# EAGLE design MWC_mobo_v1.0.7 (EAGLE 4.16)
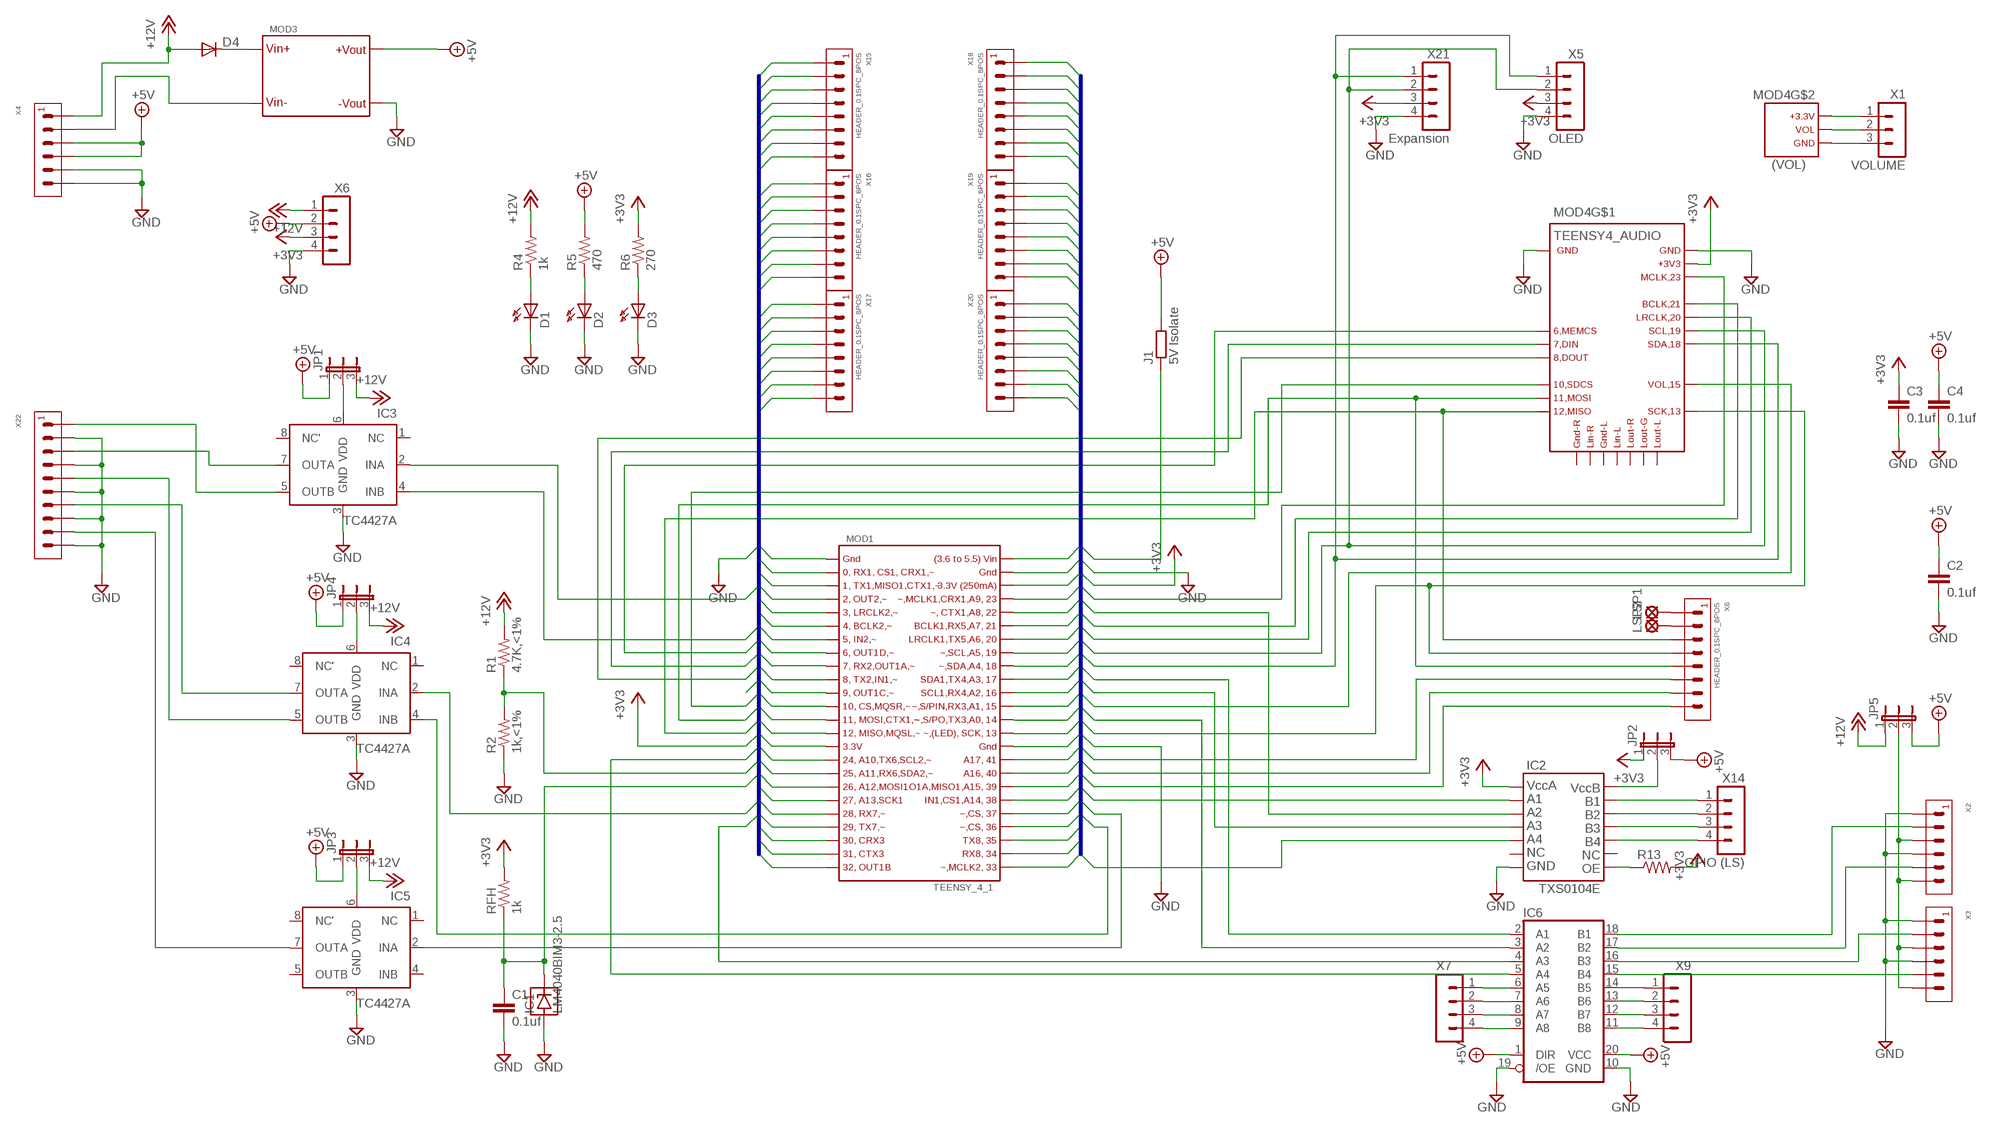
[diagram p0: schematic, sheet 1]

## Parts
C1  0.1uf  C-EUC0805K  [C0805K]
C2  0.1uf  C-EUC0805K  [C0805K]
C3  0.1uf  C-EUC0805K  [C0805K]
C4  0.1uf  C-EUC0805K  [C0805K]
D1  LED0805K  [C0805K]
D2  LED0805K  [C0805K]
D3  LED0805K  [C0805K]
D4  DIODE-SMC  [SMC]
IC1  LM4040BIM3-2.5  LM4040-SOT23  [SOT-23]
IC2  TXS0104E  TXS0104E-D  [SO14]
IC3  TC4427A  TC4427A_OA  [SO08]
IC4  TC4427A  TC4427A_OA  [SO08]
IC5  TC4427A  TC4427A_OA  [SO08]
IC6  74245-PW  [SSOP-20]
J1  5V Isolate  R-EU_R0603  [R0603@1]
JP1  JP2E  [JP2]
JP2  JP2E  [JP2]
JP3  JP2E  [JP2]
JP4  JP2E  [JP2]
JP5  JP2E  [JP2]
LSP1  LSP10  [LSP10]
LSP2  LSP10  [LSP10]
MOD1  TEENSY_4_1  [MOD-48P-0_6SPC]
MOD3  MODULE-LM2596-A  [MODULE-LM2596-A]
MOD4  TEENSY4_AUDIO  [DIP14-W]
R1  4.7K,<1%  R-US_R0805  [R0805]
R2  1k,<1%  R-US_R0805  [R0805]
R4  1k  R-US_R0805  [R0805]
R5  470  R-US_R0805  [R0805]
R6  270  R-US_R0805  [R0805]
R13  R-US_R0805  [R0805]
RFH  1k  R-US_R0603  [R0603]
X1  VOLUME  HEADER_0.1SPC_3POS  [HEADER-0.1SPC-3P]
X2  TERMINAL-BLOCK-6P-5.08-0.051D  [TERM-BLOCK_5.08SPC_6P]
X3  TERMINAL-BLOCK-6P-5.08-0.051D  [TERM-BLOCK_5.08SPC_6P]
X4  TERMINAL-BLOCK-6P-5.08-0.051D  [TERM-BLOCK_5.08SPC_6P]
X5  OLED  HEADER_0.1SPC_4POS  [HEADER-0.1SPC-4P]
X6  HEADER_0.1SPC_4POS  [HEADER-0.1SPC-4P]
X7  HEADER_0.1SPC_4POS  [HEADER-0.1SPC-4P]
X8  HEADER_0.1SPC_8POS  [HEADER-0.1SPC-8P]
X9  HEADER_0.1SPC_4POS  [HEADER-0.1SPC-4P]
X14  GPIO (LS)  HEADER_0.1SPC_4POS  [HEADER-0.1SPC-4P]
X15  HEADER_0.1SPC_8POS  [HEADER-0.1SPC-8P]
X16  HEADER_0.1SPC_8POS  [HEADER-0.1SPC-8P]
X17  HEADER_0.1SPC_8POS  [HEADER-0.1SPC-8P]
X18  HEADER_0.1SPC_8POS  [HEADER-0.1SPC-8P]
X19  HEADER_0.1SPC_8POS  [HEADER-0.1SPC-8P]
X20  HEADER_0.1SPC_8POS  [HEADER-0.1SPC-8P]
X21  Expansion  HEADER_0.1SPC_4POS  [HEADER-0.1SPC-4P]
X22  TERMINAL-BLOCK-10P-5.08-0.051D  [TERM-BLOCK_5.08SPC_10P]

## Nets
+3V3 [Power]: C3.1 IC2.1 JP2.1 MOD1.P$15 MOD1.P$46 MOD4.P$26(+3V3) R6.2 R13.2 RFH.2 X5.3 X6.3 X16.7 X18.3 X21.3
+5V [High power]: C2.1 C4.1 IC6.1(DIR) IC6.20(VCC) J1.2 JP1.1 JP2.3 JP3.1 JP4.1 JP5.3 MOD3.OUT+(VOUT+) R5.2 X4.P$3 X4.P$4 X6.2
+12V [High power]: D4.A JP1.3 JP3.3 JP4.3 JP5.1 R1.2 R4.2 X4.P$1 X6.1
GND [High power]: C1.2 C2.2 C3.2 C4.2 D1.C D2.C D3.C IC1.2(A) IC2.7 IC3.3(GND) IC4.3(GND) IC5.3(GND) IC6.10(GND) IC6.19(/OE) MOD1.P$1 MOD1.P$34 MOD1.P$47 MOD3.OUT-(VOUT-) MOD4.P$1(GND) MOD4.P$27(GND1) R2.1 X2.P$1 X2.P$4 X3.P$1 X3.P$4 X4.P$5 X4.P$6 X5.4 X6.4 X15.1 X18.2 X19.7 X21.4 X22.P$2 X22.P$4 X22.P$6 X22.P$8 X22.P$10
N$1: MOD4.VOL X1.2
N$2: MOD4.VOL_3V3 X1.1
N$3: MOD4.VOL_GND X1.3
N$4: LSP2.MP X8.2
N$5 [Power]: IC3.7(OUTA) X22.P$3
N$6: IC6.15(B4) X3.P$5
N$7: IC6.16(B3) X3.P$2
N$8: IC6.17(B2) X2.P$5
N$9: IC6.18(B1) X2.P$2
N$15: IC6.9(A8) X7.4
N$16: IC6.7(A6) X7.2
N$17: IC6.8(A7) X7.3
N$18: IC6.6(A5) X7.1
N$19: IC6.11(B8) X9.4
N$20: IC6.13(B6) X9.2
N$21: IC6.12(B7) X9.3
N$22: IC6.14(B5) X9.1
N$31: MOD3.IN-(VIN-) X4.P$2
N$32: D1.A R4.1
N$33: D2.A R5.1
N$34: D3.A R6.1
N$36: IC3.5(OUTB) X22.P$1
N$37: IC3.6(VDD) JP1.2
N$41 [Power]: IC4.7(OUTA) X22.P$7
N$50: IC4.6(VDD) JP4.2
N$51: IC2.10 X14.4
N$52: IC2.12 X14.2
N$53: IC2.11 X14.3
N$54: IC2.13 X14.1
N$57: IC2.8 R13.1
N$60: IC4.5(OUTB) X22.P$5
N$61: IC5.7(OUTA) X22.P$9
N$62 [High power]: JP5.2 X2.P$3 X2.P$6 X3.P$3 X3.P$6
N$63: IC2.14 JP2.2
N$91: LSP1.MP X8.1
N$92: IC5.6(VDD) JP3.2
N$93 [High power]: D4.C MOD3.IN+(VIN+)
P1: MOD1.P$2 X15.2
P2: MOD1.P$3 X15.3
P3: IC3.2(INA) MOD1.P$4 X15.4
P4: MOD1.P$5 X15.5
P5: MOD1.P$6 X15.6
P6: IC3.4(INB) MOD1.P$7 X15.7
P7: MOD1.P$8 MOD4.P$8(MEMCS,P6) X15.8
P8: MOD1.P$9 MOD4.P$9(DIN,P7) X16.1
P9: MOD1.P$10 MOD4.P$10(DOUT,P8) X16.2
P10: MOD1.P$11 X16.3
P11: MOD1.P$12 MOD4.P$12(SDCS,P10) X16.4
P12: MOD1.P$13 MOD4.P$13(MOSI,P11) X8.5 X16.5
P13: MOD1.P$14 MOD4.P$14(MISO,P12) X8.3 X16.6
P15: IC6.5(A4) MOD1.P$16 X16.8
P16: MOD1.P$17 R1.1 R2.2 X17.1
P17: C1.1 IC1.1(C) MOD1.P$18 RFH.1 X17.2
P18: MOD1.P$19 X17.3
P19: IC4.2(INA) MOD1.P$20 X17.4
P20: IC6.4(A3) MOD1.P$21 X17.5
P21: MOD1.P$22 X17.6
P22: MOD1.P$23 X17.7
P23: MOD1.P$24 X17.8
P24: IC2.5 MOD1.P$25 X20.8
P25: MOD1.P$26 X20.7
P26: MOD1.P$27 X20.6
P27: IC4.4(INB) MOD1.P$28 X20.5
P28: IC5.2(INA) MOD1.P$29 X20.4
P29: IC2.2 MOD1.P$30 X20.3
P30: MOD1.P$31 X8.8 X20.2
P31: MOD1.P$32 X8.7 X20.1
P32: MOD1.P$33 X8.6 X19.8
P34: MOD1.P$35 MOD4.P$15(SCK,P13) X8.4 X19.6
P35: IC6.3(A2) MOD1.P$36 X19.5
P36: MOD1.P$37 MOD4.P$17(VOL,P15) X19.4
P37: IC2.4 MOD1.P$38 X19.3
P38: IC6.2(A1) MOD1.P$39 X19.2
P39: MOD1.P$40 MOD4.P$20(SDA,P18) X5.1 X19.1 X21.1
P40: MOD1.P$41 MOD4.P$21(SCL,P19) X5.2 X18.8 X21.2
P41: MOD1.P$42 MOD4.P$22(LRCLK,P20) X18.7
P42: MOD1.P$43 MOD4.P$23(BCLK,P21) X18.6
P43: IC2.3 MOD1.P$44 X18.5
P44: MOD1.P$45 MOD4.P$25(MCLK,P23) X18.4
P47: J1.1 MOD1.P$48 X18.1
Unconnected: IC2.6 IC2.9 IC3.1(NC) IC3.8(NC') IC4.1(NC) IC4.8(NC') IC5.1(NC) IC5.4(INB) IC5.5(OUTB) IC5.8(NC') MOD4.LINL MOD4.LINLG(GL) MOD4.LINR MOD4.LINRG(GR) MOD4.LOUTG(GOUT) MOD4.LOUTL MOD4.LOUTR

## Buses
P[0..23]
P[24..47]

## Library data of the parts
C1-C4 = rcl:C-EU: CAPACITOR, European symbol
D1-D3 = avn-led:LED: LED
D4 = diode:DIODE-: DIODE
IC1 = avn:LM4040: LM4040 -- Shunt Voltage Reference
IC2 = avn-semi:TXS0104E
IC3-IC5 = avn-semi:TC4427A: TC4427A 1.5A Dual High-Speed Power MOSFET Drivers Also TC4426A , TC4428A
IC6 = avn-semi:74245: 74245 Bi-Directional Logic Transceiver
J1 = rcl:R-EU_: RESISTOR, European symbol
JP1-JP5 = jumper:JP2E: JUMPER
LSP1 LSP2 = solpad:LSP10: SOLDER PAD drill 1.0 mm, distributor Buerklin, 12H555
MOD1 = avn-teensy:TEENSY_4_1: Teensy 4.1 Module PJRC
MOD3 = avn-power:MODULE-LM2596-A: LM2596 DC-DC Converter Vin: 3.2V - 40V Vout: 1.25V - 35V Iout: 3A
MOD4 = avn-teensy:TEENSY4_AUDIO: Teensy 4 Audio Board (Rev D) for Teensy 4.0
R1 R2 R4-R6 R13 RFH = rcl:R-US_: RESISTOR, American symbol
X1 = avn-connector:HEADER_0.1SPC_3POS: Header 0.1" spacing 3-position For 0.025" x 0.025" square pins
X2-X4 = avn-connector:TERMINAL-BLOCK-6P: Terminal Block 6-position
X5-X7 X9 X14 X21 = avn-connector:HEADER_0.1SPC_4POS: Header 0.1" spacing 4-position For 0.025" x 0.025" square pins
X8 X15-X20 = avn-connector:HEADER_0.1SPC_8POS: Header 0.1" spacing 8-position For 0.025" x 0.025" square pins
X22 = avn-connector:TERMINAL-BLOCK-10P: Screw Terminal Block

## Net classes
1 Power: width 0.508 mm
2 High power: width 0.762 mm

## Board
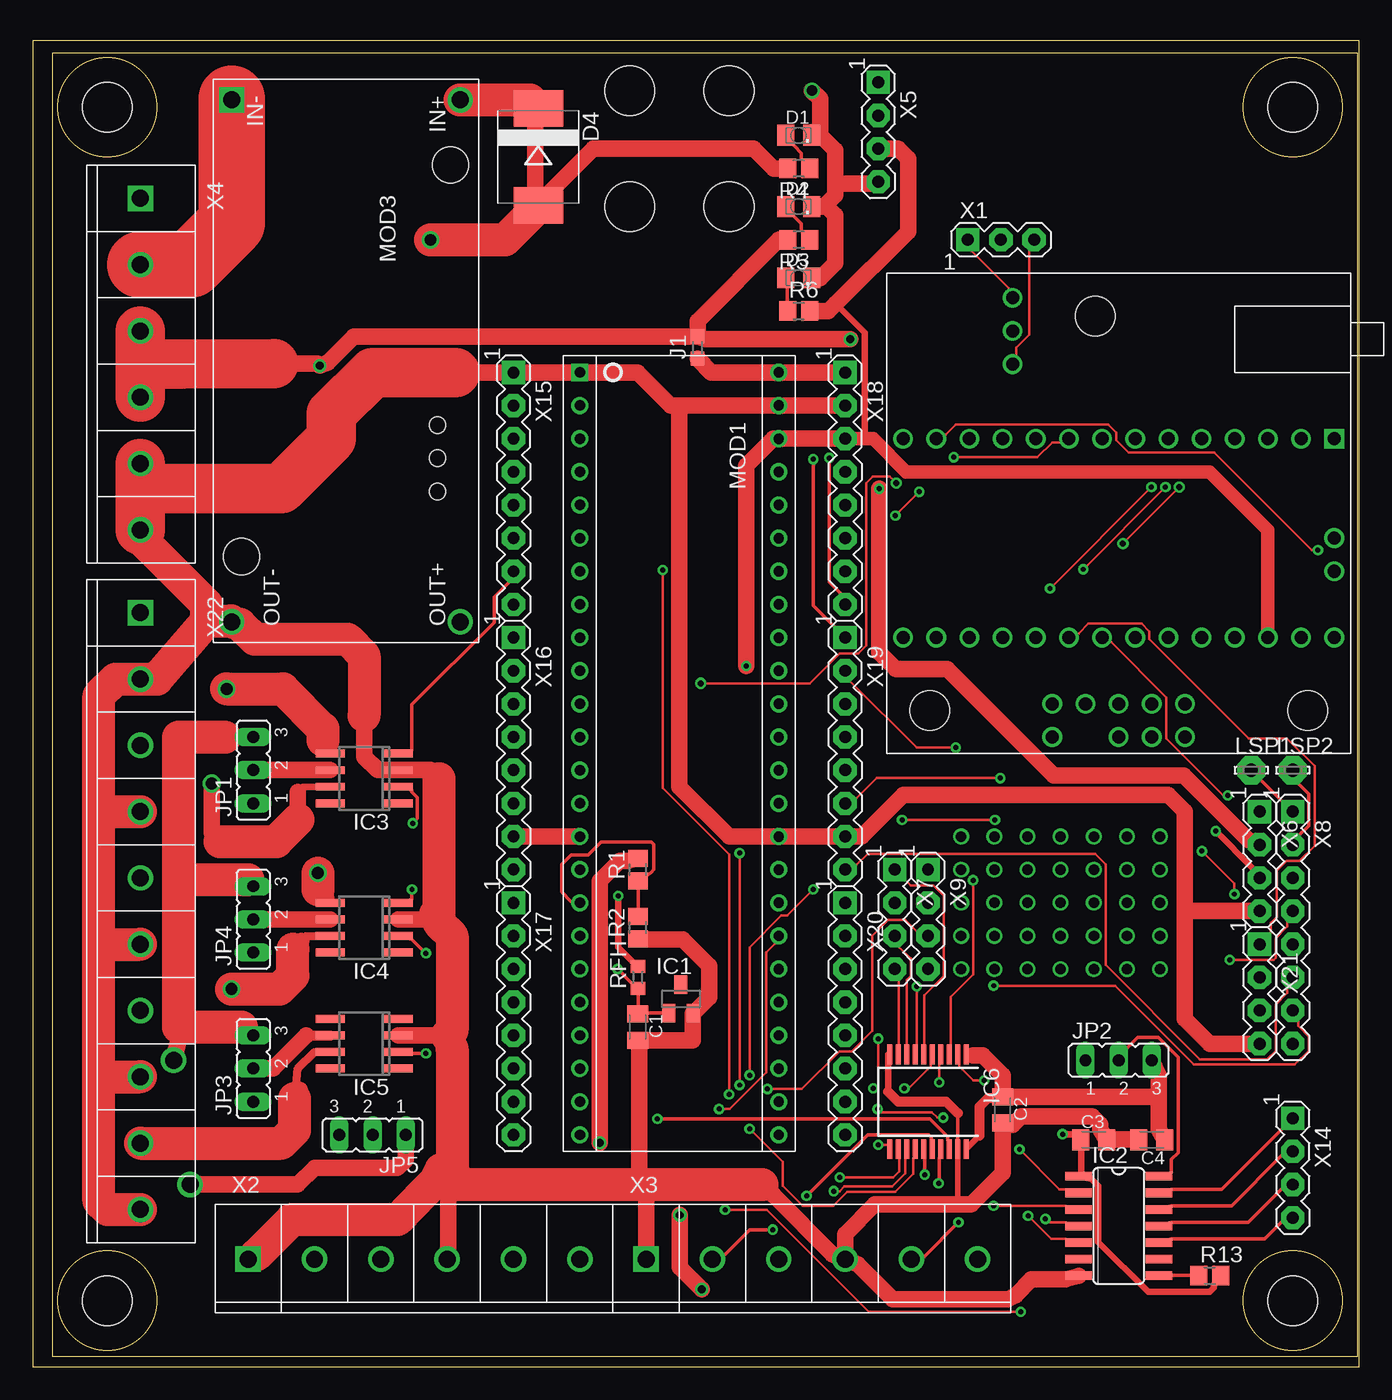
[diagram p1: board, top side]
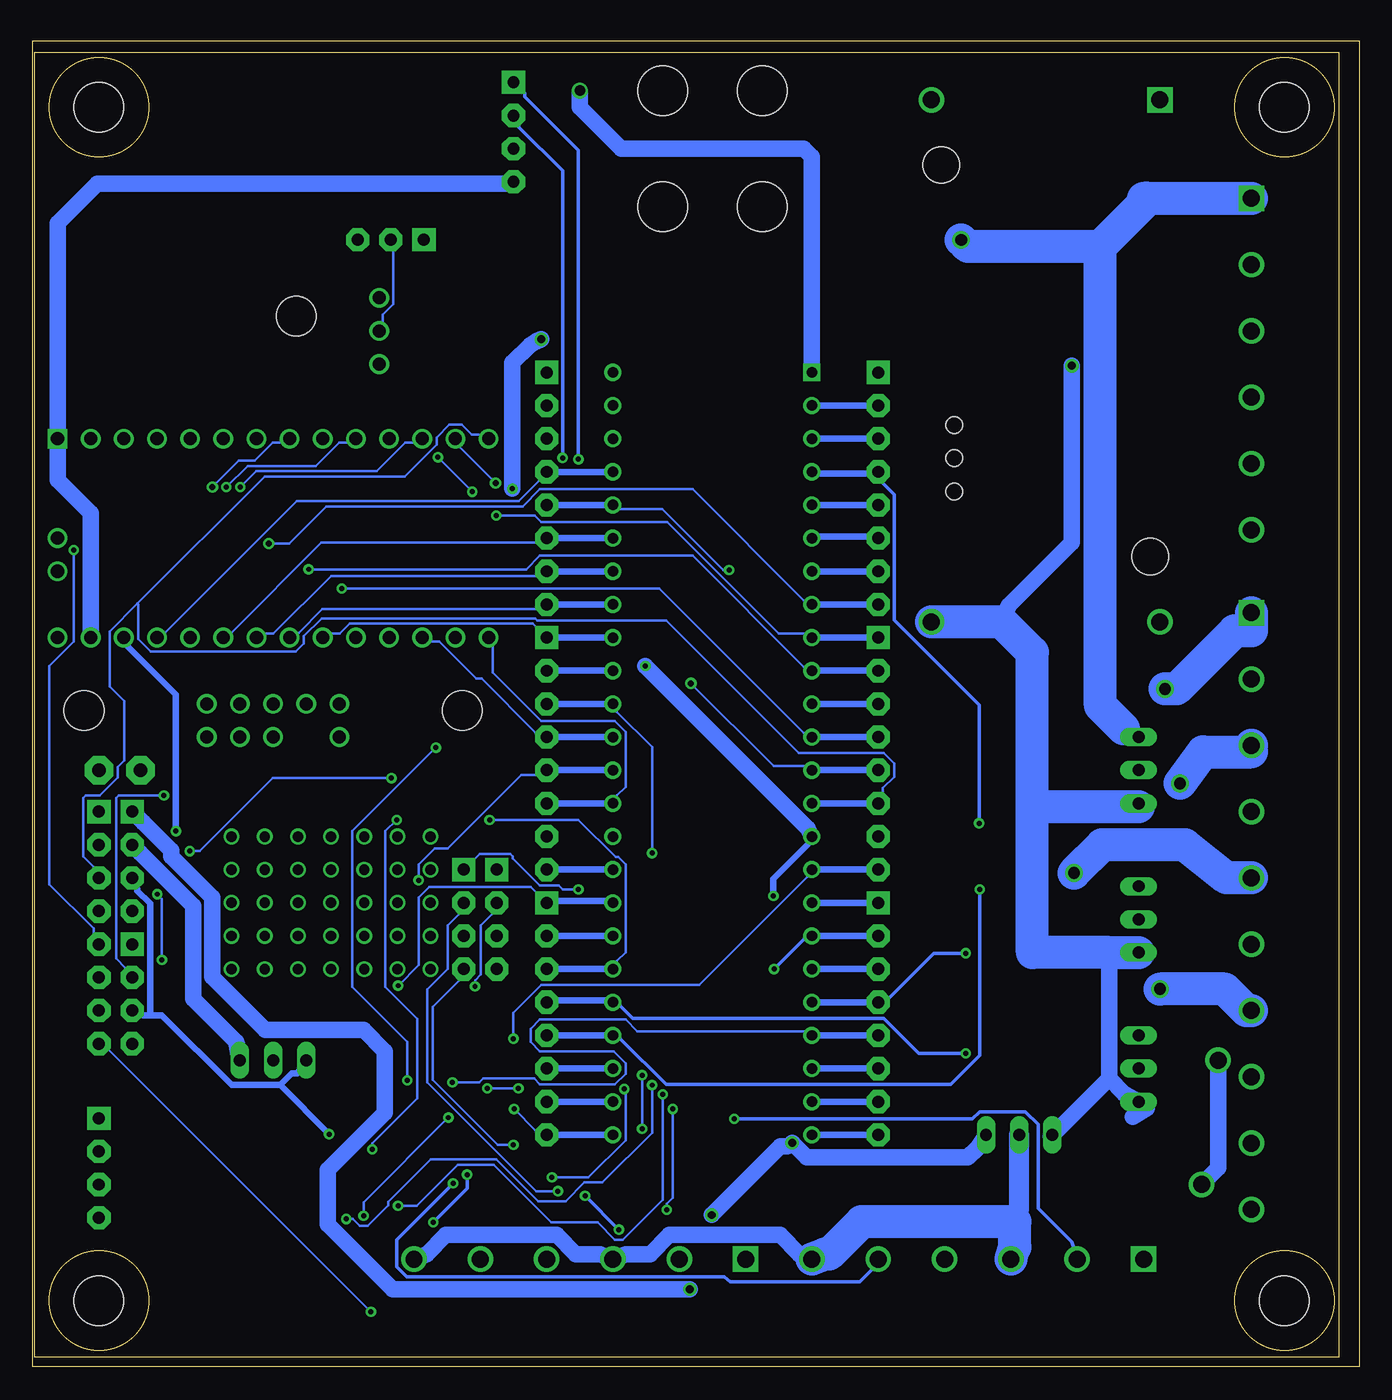
[diagram p2: board, bottom side, seen from below]

Size 101.6 x 101.6 mm. Coordinates in mm from the lower left corner, seen from the top.
Outline: 0,0 101.6,0 101.6,101.6 0,101.6 0,0
Outline: circle at 5.71,96.52 radius 3.81
Outline: circle at 5.71,5.08 radius 3.81
Outline: circle at 96.52,5.08 radius 3.81
Outline: circle at 96.52,96.52 radius 3.81
Copper layers (1*16): Top 0.035mm / dielectric 1.5mm / Bottom 0.035mm
Design rules "default": minimum track width 8mil, minimum drill 15mil, track to track 8mil, track to pad 8mil, pad to pad 8mil, via to via 8mil, smd to smd 8mil, copper to edge 40mil, drill to drill 8mil, minimum pad ring 10mil, minimum via ring 8mil, stop-mask expansion 4mil, vias tented up to drill 16mil, thermal gap 10mil
Holes 3.81 mm at 45.72,88.9 53.34,88.9 45.72,97.79 53.34,97.79 96.52,96.52 96.52,5.08 5.71,5.08 5.71,96.52
Milling: 4 lines

### Footprints (pad centres in the part's own frame; a part is rotated, then mirrored left to right if it is on the bottom)
C0805K = smd 1.3 x 1.6: 1 -1,0; 2 1,0
C0805K' = smd 1.3 x 1.6: A -1,0; C 1,0
SMC = smd 2.8 x 3.8: A 3.7,0; C -3.7,0
SOT-23 = smd 1 x 1.4: 1 -0.95,-1.1; 2 0.95,-1.1; 3 0,1.1
SO14 = smd 0.66 x 2.032: 1 -4.445,-3.073; 2 -3.175,-3.073; 3 -1.905,-3.073; 4 -0.635,-3.073; 5 0.635,-3.073; 6 1.905,-3.073; 7 3.175,-3.073; 8 3.175,3.073; 9 1.905,3.073; 10 0.635,3.073; 11 -0.635,3.073; 12 -1.905,3.073; 13 -3.175,3.073; 14 -4.445,3.073
SO08 = smd 0.6 x 2.2: 1 -1.905,-2.6; 2 -0.635,-2.6; 3 0.635,-2.6; 4 1.905,-2.6; 5 1.905,2.6; 6 0.635,2.6; 7 -0.635,2.6; 8 -1.905,2.6
SSOP-20 = smd 0.4 x 1.5: 1 -2.925,-3.625; 2 -2.275,-3.625; 3 -1.625,-3.625; 4 -0.975,-3.625; 5 -0.325,-3.625; 6 0.325,-3.625; 7 0.975,-3.625; 8 1.625,-3.625; 9 2.275,-3.625; 10 2.925,-3.625; 11 2.925,3.625; 12 2.275,3.625; 13 1.625,3.625; 14 0.975,3.625; 15 0.325,3.625; 16 -0.325,3.625; 17 -0.975,3.625; 18 -1.625,3.625; 19 -2.275,3.625; 20 -2.925,3.625
R0603@1 = smd 1.1 x 1: 1 -0.85,0; 2 0.85,0
JP2 = drill 0.914 long: 1 -2.54,0; 2 0,0; 3 2.54,0
LSP10 = drill 1.016 pad 2.159 octagon: MP 0,0
MOD-48P-0_6SPC = drill 0.8 square: P$1 -29.21,-7.62 | drill 0.8 round: P$2 -26.67,-7.62; P$3 -24.13,-7.62; P$4 -21.59,-7.62; P$5 -19.05,-7.62; P$6 -16.51,-7.62; P$7 -13.97,-7.62; P$8 -11.43,-7.62; P$9 -8.89,-7.62; P$10 -6.35,-7.62; P$11 -3.81,-7.62; P$12 -1.27,-7.62; P$13 1.27,-7.62; P$14 3.81,-7.62; P$15 6.35,-7.62; P$16 8.89,-7.62; P$17 11.43,-7.62; P$18 13.97,-7.62; P$19 16.51,-7.62; P$20 19.05,-7.62; P$21 21.59,-7.62; P$22 24.13,-7.62; P$23 26.67,-7.62; P$24 29.21,-7.62; P$25 29.21,7.62; P$26 26.67,7.62; P$27 24.13,7.62; P$28 21.59,7.62; P$29 19.05,7.62; P$30 16.51,7.62; P$31 13.97,7.62; P$32 11.43,7.62; P$33 8.89,7.62; P$34 6.35,7.62; P$35 3.81,7.62; P$36 1.27,7.62; P$37 -1.27,7.62; P$38 -3.81,7.62; P$39 -6.35,7.62; P$40 -8.89,7.62; P$41 -11.43,7.62; P$42 -13.97,7.62; P$43 -16.51,7.62; P$44 -19.05,7.62; P$45 -21.59,7.62; P$46 -24.13,7.62; P$47 -26.67,7.62; P$48 -29.21,7.62
MODULE-LM2596-A = drill 1.3 round: IN+ -20.003,8.75; OUT+ 20.003,8.75; OUT- 20.003,-8.75 | drill 1.3 square: IN- -20.003,-8.75 | hole 2.794: -15.001,8.001; 15.001,-8.001 | hole 1.27: 10.008,7.01; 7.468,7.01; 4.928,7.01
DIP14-W = drill 1 round: LINL 12.7,3.81; LINLG 15.24,3.81; LINR 12.7,1.27; LINRG 15.24,1.27; LOUTG 12.7,-3.81; LOUTL 12.7,-6.35; LOUTR 12.7,-1.27; P$2 -7.62,12.7; P$3 -7.62,10.16; P$4 -7.62,7.62; P$5 -7.62,5.08; P$6 -7.62,2.54; P$7 -7.62,0; P$8 -7.62,-2.54; P$9 -7.62,-5.08; P$10 -7.62,-7.62; P$11 -7.62,-10.16; P$12 -7.62,-12.7; P$13 -7.62,-15.24; P$14 -7.62,-17.78; P$15 7.62,-17.78; P$16 7.62,-15.24; P$17 7.62,-12.7; P$18 7.62,-10.16; P$19 7.62,-7.62; P$20 7.62,-5.08; P$21 7.62,-2.54; P$22 7.62,0; P$23 7.62,2.54; P$24 7.62,5.08; P$25 7.62,7.62; P$26 7.62,10.16; P$27 7.62,12.7; P$28 7.62,15.24; P$33 15.24,-6.35; P$36 15.24,-1.27; P$41 0,15.24; P$42 2.54,15.24; VOL -15.875,-9.398; VOL_3V3 -18.415,-9.398; VOL_GND -13.335,-9.398 | drill 1 square: P$1 -7.62,15.24 | hole 3.048: -17.018,-3.048; 13.208,13.208; 13.208,-15.748
R0805 = smd 1.3 x 1.5: 1 -0.85,0; 2 0.85,0
R0603 = smd 1 x 1.1: 1 -0.85,0; 2 0.85,0
HEADER-0.1SPC-3P = drill 0.914 pad 1.778 square: 1 -2.54,0 | drill 0.914 pad 1.778 octagon: 2 0,0; 3 2.54,0
TERM-BLOCK_5.08SPC_6P = drill 1.3 square: P$1 0,0 | drill 1.3 round: P$2 5.08,0; P$3 10.16,0; P$4 15.24,0; P$5 20.32,0; P$6 25.4,0
HEADER-0.1SPC-4P = drill 0.914 pad 1.778 square: 1 -3.81,0 | drill 0.914 pad 1.778 octagon: 2 -1.27,0; 3 1.27,0; 4 3.81,0
HEADER-0.1SPC-8P = drill 0.914 pad 1.778 square: 1 -8.89,0 | drill 0.914 pad 1.778 octagon: 2 -6.35,0; 3 -3.81,0; 4 -1.27,0; 5 1.27,0; 6 3.81,0; 7 6.35,0; 8 8.89,0
TERM-BLOCK_5.08SPC_10P = drill 1.3 square: P$1 0,0 | drill 1.3 round: P$2 5.08,0; P$3 10.16,0; P$4 15.24,0; P$5 20.32,0; P$6 25.4,0; P$7 30.48,0; P$8 35.56,0; P$9 40.64,0; P$10 45.72,0

### Placement (x,y rotation side)
C1  46.35,26.04 270 top
C2  74.3,19.68 270 top
C3  81.28,17.4 0 top
C4  85.72,17.4 180 top
D1  [C0805K']  58.67,94.36 0 top
D2  [C0805K']  58.67,88.9 0 top
D3  [C0805K']  58.67,83.44 0 top
D4  38.73,92.71 270 top
IC1  49.66,28.19 0 top
IC2  83.19,10.16 270 top
IC3  25.4,45.09 90 top
IC4  25.4,33.66 90 top
IC5  25.4,24.77 90 top
IC6  68.58,20.32 180 top
J1  50.93,78.11 90 top
JP1  16.89,45.72 90 top
JP2  83.19,23.5 0 top
JP3  16.89,22.86 90 top
JP4  16.89,34.29 90 top
JP5  26.04,17.78 180 top
LSP1  93.34,45.72 0 top
LSP2  96.52,45.72 0 top
MOD1  49.53,46.99 270 top
MOD3  24,77.09 270 top
MOD4  84.45,63.5 270 top
R1  46.35,38.1 90 top
R2  46.35,33.66 90 top
R4  58.67,91.82 180 top
R5  58.67,86.36 180 top
R6  58.67,80.9 0 top
R13  90.17,6.99 0 top
RFH  46.35,29.84 90 top
X1  74.17,86.36 0 top
X2  16.51,8.26 0 top
X3  46.99,8.26 0 top
X4  8.26,89.53 270 top
X5  64.77,94.61 270 top
X6  93.98,38.73 270 top
X7  66.04,34.29 270 top
X8  96.52,33.66 270 top
X9  68.58,34.29 270 top
X14  96.52,15.24 270 top
X15  36.83,67.31 270 top
X16  36.83,46.99 270 top
X17  36.83,26.67 270 top
X18  62.23,67.31 270 top
X19  62.23,46.99 270 top
X20  62.23,26.67 270 top
X21  93.98,28.57 270 top
X22  8.26,57.78 270 top

### Tracks (layer width: path | path; a pad name or v marks a point on that pad's centre or on a via)
+3V3  (via drill 0.38)
  Top 0.508: R13.2 90.47,6.25 90.47,6.04 90.17,5.74 85.45,5.74 81.64,9.55 81.64,13.87 81.08,14.43 IC2.1 80.31,14.88 80.31,16.61 C3.1 79.65,17.83 v78.89,17.83 | v44.86,36.09 44.86,32.16 45.82,31.19 RFH.2 | 56.74,71.14 57.02,71.12 | 61.53,81.47 63.75,79.25 63.75,71.12 | v90.63,41.05 93.47,38.2 X6.3
  Top 1.016: X18.3 63.75,71.12 64.39,71.12 66.93,68.58 90.17,68.58 94.61,64.14 MOD4.P$26
  Top 1.27: 57.02,71.12 MOD1.P$46 X18.3 | MOD1.P$15 X16.7 | X5.3 66.29,93.34 67.06,92.58 67.06,87 61.53,81.47 60.96,80.9 R6.2 | v54.66,53.7 54.66,69.06 56.74,71.14
  Bottom 0.508: 82.65,21.59 81.74,22.5 81.33,22.5 JP2.1 | 82.65,21.59 86.36,21.59 91.69,26.92 92.61,26.92 | 92.61,26.92 93.12,26.92 X21.3 | X6.3 93.57,36.63 93.57,36.47 92.61,35.51 92.61,26.92 | 82.65,21.59 v78.89,17.83 | v44.86,36.09 44.86,37.39 42.22,40.03 MOD1.P$15 | v90.63,41.05 90.63,51.51 94.28,55.17 MOD4.P$26
  Bottom 1.27: v54.66,53.7 42.22,41.25 MOD1.P$15
+5V  (via drill 0.38, 0.61)
  Top 0.381: IC6.1 71.5,23.88 72.01,23.88
  Top 0.406: 72.52,17.71 IC6.20
  Top 0.762: 72.52,17.71 72.52,19.94 73.15,20.57 74.3,20.57 C2.1 75.08,20.68
  Top 1.27: 18.47,76.86 21.84,76.86 v22,76.71 22.61,76.96 24.59,78.94 50.34,78.94 J1.2 | C2.1 74.3,22.35 72.77,23.88 72.01,23.88 | R5.2 57.15,86.36 50.93,80.14 J1.2 | 86.26,20.68 86.26,22.35 JP2.3 | 86.26,20.68 86.26,18.19 C4.1 | 86.26,20.68 75.08,20.68 | v62.64,78.74 51.51,78.74 J1.2 | v64.85,67.28 64.85,54.74 66.12,53.47 70.05,53.47 78.21,45.31 88.19,45.31 93.12,40.39 X6.2
  Top 3.81: 8.26,76.83 X4.P$4 | 8.26,76.83 X4.P$3 | 18.47,76.86 11.46,76.83 8.26,76.83
  Bottom 1.27: JP1.1 16.92,43.18 16.92,42.93 | 17.32,19.15 16.26,19.81 16.38,19.81 JP3.1 17.98,20.93 19.15,22.1 | 19.15,22.1 19.15,31.75 | v22,76.71 22,63.14 26.82,58.32 27.37,57.09 | JP5.3 23.62,17.65 23.6,17.65 19.15,22.1 | X6.2 93.37,39.37 89.31,35.31 89.31,28.19 86,24.89 JP2.3 | v62.64,78.74 63.07,78.56 63.5,78.31 64.85,76.96 v64.85,67.28
  Bottom 2.54: MOD3.OUT+ 27.37,57.09 25.02,54.74 25.02,43.05 | 25.02,43.05 24.38,42.93 16.92,42.93 16.89,42.93 | JP4.1 19.15,31.75 25.02,31.75 25.02,43.05
+12V  (via drill 0.61, 0.9, 1.3)
  Top 1.27: JP4.3 16.64,36.83 16.51,37.34 | 14.73,48.26 JP1.3 | JP3.3 16.26,26.04 16,26.04 | JP5.1 28.57,15.88 27.94,15.24 21.59,15.24 20.32,13.97 v12.06,13.97 | v10.79,23.5 11.43,26.04 | R4.2 56.77,91.82 55.24,93.34 42.93,93.34 38.61,89.03 38.72,89.03 D4.A | v43.43,17.17 43.43,37.24 44.96,38.76 45.62,38.76 R1.2 | v51.26,5.94 49.58,7.62 v49.58,11.63
  Top 2.54: 11.18,37.34 16.51,37.34 | 11.18,37.34 11.18,48.26 14.73,48.26 | 16,26.04 11.43,26.04 11.18,26.04 11.18,37.34 | D4.A 38.73,88.9 36.2,86.36 v30.48,86.36
  Bottom 1.27: JP1.3 17.4,48.26 18.03,48.9 | v12.06,13.97 10.79,15.24 v10.79,23.5 | 43.36,17.09 42.32,16.05 29.97,16.05 29.26,16.76 JP5.1 | 43.36,17.09 v43.43,17.17 | v51.26,5.94 74.02,5.94 78.99,10.92 78.99,15.09 74.62,19.46 74.62,24.18 76.25,25.81 83.77,25.81 87.83,29.87 87.83,35.97 90.98,39.12 90.98,39.57 93.12,41.71 X6.1 | 43.36,17.09 43.81,16.89 44.32,16.89 v49.58,11.63
  Bottom 2.54: 16.13,89.53 16.51,89.53 | 18.03,48.9 19.81,50.67 19.81,85.85 | 19.81,85.85 16.13,89.53 | 16.13,89.53 X4.P$1 | 19.81,85.85 29.97,85.85 v30.48,86.36
GND  (via drill 0.8)
  Top 0.254: 65.53,23.95 IC6.10 | 70.87,19.43 IC6.19 70.87,16.68
  Top 0.406: 70.87,12.45 70.87,16.68
  Top 0.508: 65.53,21.08 65.53,23.95
  Top 0.762: 65.53,21.08 66.29,20.32 69.98,20.32 70.87,19.43
  Top 1.27: 32.38,76.2 X15.1 MOD1.P$1 46.35,76.2 48.9,73.66 49.53,73.66 | 31.11,34.92 30.86,34.67 30.48,34.29 IC4.3 | 31.11,45.09 30.48,45.72 IC3.3 26.42,45.72 25.4,46.74 25.4,49.91 | 32.13,24.38 31.75,25.4 IC5.3 | 8.26,63.5 X4.P$6 | X3.P$4 63.2,7.87 65.89,5.18 74.7,5.18 75.29,5.49 76.5,6.71 79.15,6.71 IC2.7 | X2.P$4 31.85,9.2 31.85,12.75 32.38,13.97 | X3.P$1 46.99,13.97 46.48,13.97 46.48,25.04 C1.2 50.55,25.04 50.55,27.09 IC1.2 51.82,28.3 51.82,30.73 49.78,32.77 46.35,32.77 R2.1 | 17.12,8.56 17.22,8.56 X2.P$1 | X3.P$4 61.27,8.64 56.79,13.11 55.88,13.97 | MOD1.P$47 57.28,73.66 | 49.53,73.66 MOD1.P$47 | MOD1.P$47 X18.2 | X3.P$4 62.23,10.16 64.52,12.45 70.87,12.45 71.88,12.45 74.3,14.86 C2.2 75.08,18.54 75.74,19.2 81.18,19.2 81.79,18.59 81.79,18.19 C3.2 82.91,17.42 84.12,17.42 C4.2 | 49.53,73.66 49.53,44.45 53.34,40.64 MOD1.P$34 X19.7 63.5,40.64 66.67,43.81 87,43.81 88.27,42.55 88.27,34.92 | v59.69,97.79 60.33,97.16 60.33,94.61 59.69,94.61 59.69,94.38 D1.C 60.33,94.36 61.47,93.22 61.47,90.68 | 61.47,90.68 61.47,89.79 60.58,88.9 60.45,88.9 | 60.45,88.9 D2.C | X5.4 64.64,90.68 61.47,90.68 | D3.C 60.33,83.44 61.47,84.58 61.47,88.27 60.83,88.9 60.45,88.9 | 88.27,34.92 X6.4 | X21.4 90.17,24.77 88.27,26.67 88.27,34.92
  Top 2.54: 32.13,14.61 32.38,14.61 32.38,13.97 46.99,13.97 55.88,13.97 | 31.11,45.09 31.11,34.92 | 25.4,49.91 25.4,54.48 24.13,55.75 17.02,55.75 15.88,56.9 MOD3.OUT- 15.19,57.15 13.34,57.15 | 32.13,24.38 32.13,14.61 | 32.13,14.61 31.27,15.11 30.84,14.22 29.95,13.34 27.96,11.28 19.84,11.28 17.12,8.56 | 13.34,57.15 9.53,52.7 X22.P$2 6.35,52.7 5.08,51.44 5.08,42.55 | 5.08,22.23 5.08,12.7 5.71,12.06 X22.P$10 | 5.08,22.23 5.08,32.38 | 5.08,32.38 5.08,42.55 | 5.08,42.55 X22.P$4 | 5.08,32.38 X22.P$6 | 5.08,22.23 X22.P$8 | 13.34,57.15 13.34,58.42 8.26,63.5 | 31.75,25.4 32.13,25.78 32.13,33.02 31.11,34.04 31.11,34.42 30.86,34.67
  Top 3.81: 32.38,76.2 26.04,76.2 22.86,73.03 22.86,71.12 19.05,67.31 8.26,67.31 | X4.P$6 8.26,67.31 | 8.26,67.31 X4.P$5
  Bottom 1.27: MOD1.P$1 41.91,92.71 42.55,93.34 56.52,93.34 59.69,96.52 v59.69,97.79 | X5.4 64.77,90.68 96.65,90.68 99.69,87.63 MOD4.P$1 99.69,67.94 97.16,65.41 MOD4.P$27
N$1
  Bottom 0.203: MOD4.VOL 74.78,80.11 74.78,80.62 73.97,81.43 73.97,85.5 X1.2
N$2
  Top 0.203: MOD4.VOL_3V3 74.78,82.65 71.93,85.5 X1.1
N$3
  Top 0.203: MOD4.VOL_GND 75.34,77.57 75.34,78.08 76.35,79.1 76.35,85.5 X1.3
N$4
  Top 0.254: X8.2 97.03,40.74 97.74,41.45 97.74,43.89 96.98,44.65 LSP2.MP
N$5  (via drill 0.9)
  Top 0.508: IC3.7 20.7,44.45 20.32,44.07
  Top 1.27: 20.32,41.91 20.32,44.07 | 14.35,40.26 13.72,40.89 v13.72,44.7
  Top 2.54: 20.32,41.91 18.67,40.26 14.35,40.26
  Bottom 2.54: v13.72,44.7 11.94,47.12 8.26,47.12 X22.P$3
N$6  (via drill 0.38)
  Top 0.254: v68.33,14.73 68.33,15.95 IC6.15 | v70.92,11.07 68.28,8.43 X3.P$5
  Bottom 0.254: v68.33,14.73 68.33,13.66 v70.92,11.07
N$7  (via drill 0.38)
  Top 0.254: v59.28,13.11 63.96,17.78 68.63,17.78 68.83,17.58 68.83,17.42 IC6.16 | v56.69,10.52 54.91,10.52 53.03,8.64 X3.P$2
  Bottom 0.254: v56.69,10.52 v59.28,13.11
N$8  (via drill 0.38)
  Top 0.254: v69.39,14.07 69.44,13.87 69.44,15.95 IC6.17
  Bottom 0.254: v69.39,14.07 73.71,9.75 73.71,7.67 72.95,6.91 48.62,6.91 48.18,6.53 38.25,6.53 36.91,7.87 X2.P$5
N$9  (via drill 0.38)
  Top 0.254: v47.85,19 68.73,19 70.1,17.63 70.1,17.42 IC6.18
  Bottom 0.254: v47.85,19 29.62,19 29.06,19.56 25.55,19.56 24.59,18.59 24.59,12.17 22,9.58 X2.P$2
N$10
  Top 1.27: 38.61,89.66 38.48,89.79 38.48,96.65
N$15
  Top 0.203: IC6.9 66.34,24.69 66.34,29.62 X7.4
N$16  (via drill 0.38)
  Top 0.203: v67.72,29.16 67.72,24.69 IC6.7
  Bottom 0.203: v67.72,29.16 67.72,29.62 67.26,30.07 67.26,33.83 66.4,34.7 X7.2
N$17
  Top 0.203: IC6.8 66.95,24.69 66.95,29.67 67.26,29.97 67.26,31.29 66.4,32.16 X7.3
N$18
  Top 0.203: IC6.6 68.28,24.69 68.28,28.45 69.8,29.97 69.8,36.07 68.99,36.88 67.26,36.88 X7.1
N$19  (via drill 0.38)
  Top 0.203: v64.77,17.02 65.48,17.02 IC6.11
  Bottom 0.203: v64.77,17.02 65.99,17.02 70.97,22 70.97,27.58 68.94,29.62 X9.4
N$20  (via drill 0.38)
  Top 0.203: v61.37,13.46 61.82,13.46 62.18,13.82 65.84,13.82 66.85,14.83 66.85,15.95 IC6.13
  Bottom 0.203: v61.37,13.46 63.04,13.46 71.37,21.79 71.37,28.91 69.8,30.48 69.8,33.83 68.94,34.7 X9.2
N$21  (via drill 0.38)
  Top 0.203: v61.82,14.53 65.94,14.53 66.4,14.99 66.4,15.95 IC6.12 | v56.29,21.29 58.93,21.29 61.82,24.18 62.74,24.18 64.31,25.76 64.31,33.02 65.53,34.24 66.85,34.24 67.72,33.38 X9.3
  Bottom 0.203: v61.82,14.53 59.03,14.53 56.19,17.37 56.19,21.18 v56.29,21.29
N$22  (via drill 0.38)
  Top 0.203: v54.91,18.24 57.45,15.7 57.45,13.87 58.98,12.34 61.32,12.34 62.38,13.41 66.09,13.41 67.46,14.78 67.46,15.95 IC6.14 | v54.91,22.35 54.91,32.16 57.35,34.59 57.81,34.59 v59.79,36.58
  Bottom 0.203: v54.91,18.24 v54.91,22.35 | v59.79,36.58 61.01,36.58 61.32,36.88 62.74,36.88 64.82,38.96 64.82,39.12 65.02,39.32 67.36,39.32 X9.1
N$28  (via drill 0.8)
  other vias: 71.12,40.64
N$29  (via drill 0.8)
  other vias: 73.66,40.64
N$30  (via drill 0.8)
  other vias: 76.2,40.64
N$31
  Top 5.08: 15.24,97.1 15.24,97.16 | 15.24,97.1 MOD3.IN- | 15.24,97.1 15.24,87.63 12.06,84.45 X4.P$2
N$32
  Top 0.254: R4.1 58.88,92.56 58.88,93.02 58.32,93.57 D1.A
N$33
  Top 0.254: R5.1 58.88,87.07 58.88,87.58 58.32,88.14 D2.A
N$34
  Top 0.254: R6.1 57.78,81.53 57.78,82.68 D3.A
N$35  (via drill 0.8)
  other vias: 78.74,40.64
N$36  (via drill 0.9)
  Top 0.508: IC3.5 22.73,46.99 22.73,47.5
  Top 1.27: 22.23,48.01 22.73,47.5
  Top 2.54: 22.23,48.01 22.23,48.9 19.18,51.94 v14.86,51.94
  Bottom 2.54: v14.86,51.94 13.97,51.94 9.53,56.39 8.26,56.39 X22.P$1
N$37
  Top 1.27: JP1.2 IC3.6
N$38  (via drill 0.8)
  other vias: 81.28,40.64
N$39  (via drill 0.8)
  other vias: 83.82,40.64
N$41  (via drill 0.9)
  Top 0.61: IC4.7 20.95,33.02 20.57,32.64
  Top 1.27: 19.94,32 20.57,32.64
  Top 2.54: 19.94,32 19.94,29.97 18.92,28.96 v15.24,28.96
  Bottom 2.54: v15.24,28.96 10.29,28.96 8.64,27.3 X22.P$7
N$44  (via drill 0.8)
  other vias: 71.12,38.1
N$45  (via drill 0.8)
  other vias: 73.66,38.1
N$46  (via drill 0.8)
  other vias: 76.2,38.1
N$47  (via drill 0.8)
  other vias: 78.74,38.1
N$48  (via drill 0.8)
  other vias: 81.28,38.1
N$49  (via drill 0.8)
  other vias: 83.82,38.1
N$50
  Top 1.27: JP4.2 IC4.6
N$51
  Top 0.254: IC2.10 87.22,9.8 94.39,9.8 95.66,11.07 X14.4
N$52
  Top 0.254: IC2.12 87.22,12.34 91.85,12.34 95.66,16.15 X14.2
N$53
  Top 0.254: IC2.11 87.22,11.07 93.12,11.07 95.66,13.61 X14.3
N$54
  Top 0.254: IC2.13 87.22,13.61 91.08,13.61 X14.1
N$57
  Top 0.254: R13.1 88.7,7.01 87.22,7.01 IC2.8
N$58  (via drill 0.8)
  other vias: 86.36,40.64
N$59  (via drill 0.8)
  other vias: 86.36,38.1
N$60  (via drill 0.9)
  Top 0.61: IC4.5 22.48,35.88 22.48,35.94
  Top 1.27: 21.84,36.58 22.48,35.94
  Top 2.54: v21.84,37.85 21.84,36.58
  Bottom 2.54: v21.84,37.85 19.68,40.01 13.34,40.01 10.16,37.47 X22.P$5
N$61
  Top 0.61: IC5.7 21.59,24.13 20.32,22.86 20.19,21.59 20.45,21.21
  Top 1.27: 20.45,21.21 20.07,21.21 20.07,20.57
  Top 2.54: 20.07,20.57 20.07,18.16 19.05,17.14 X22.P$9
N$62
  Bottom 1.27: X3.P$6 71.42,8.64 69.95,10.11 61.47,10.11 59.99,8.64 58.12,8.64 X3.P$3 56.19,8.64 54.3,8.64 52.83,10.11 44.35,10.11 42.88,8.64 X2.P$6 | 26.36,11.12 26.36,11.33 26.04,12.05 | 40.59,8.64 40.95,8.64
  Bottom 1.524: 26.04,12.05 JP5.2
  Bottom 2.54: X2.P$3 26.36,9.2 26.36,11.12 38.1,11.12 40.59,8.64 | 40.95,8.64 X2.P$6
N$63
  Top 0.254: IC2.14 87.22,14.88 87.22,15.9 87.73,16.41 87.73,23.72 86.21,25.25 84.63,25.25 83.87,24.49 JP2.2
N$66  (via drill 0.8)
  other vias: 71.12,35.56
N$67  (via drill 0.8)
  other vias: 73.66,35.56
N$68  (via drill 0.8)
  other vias: 76.2,35.56
N$69  (via drill 0.8)
  other vias: 78.74,35.56
N$70  (via drill 0.8)
  other vias: 81.28,35.56
N$71  (via drill 0.8)
  other vias: 83.82,35.56
N$72  (via drill 0.8)
  other vias: 86.36,35.56
N$75  (via drill 0.8)
  other vias: 71.12,33.02
N$76  (via drill 0.8)
  other vias: 73.66,33.02
N$77  (via drill 0.8)
  other vias: 76.2,33.02
N$78  (via drill 0.8)
  other vias: 78.74,33.02
N$79  (via drill 0.8)
  other vias: 81.28,33.02
N$80  (via drill 0.8)
  other vias: 83.82,33.02
N$81  (via drill 0.8)
  other vias: 86.36,33.02
N$84  (via drill 0.8)
  other vias: 71.12,30.48
N$85  (via drill 0.8)
  other vias: 73.66,30.48
N$86  (via drill 0.8)
  other vias: 76.2,30.48
N$87  (via drill 0.8)
  other vias: 78.74,30.48
N$88  (via drill 0.8)
  other vias: 81.28,30.48
N$89  (via drill 0.8)
  other vias: 83.82,30.48
N$90  (via drill 0.8)
  other vias: 86.36,30.48
N$91
  Top 0.254: X8.1 95.66,43.38 94.08,44.96 LSP1.MP
N$92
  Top 0.762: 20.95,25.4 IC5.6
  Top 1.27: JP3.2 18.41,22.86 20.95,25.4
N$93
  Top 1.27: D4.C 38.76,96.42 38.1,97.09
  Top 2.54: MOD3.IN+ 38.1,97.09 38.1,96.52
P1
  Bottom 0.508: X15.2 MOD1.P$2
P2
  Bottom 0.508: X15.3 MOD1.P$3
P3  (via drill 0.38)
  Top 0.254: v29.11,41.66 29.46,42.01 29.46,43.64 29.06,44.04 29.06,44.2 IC3.2
  Bottom 0.254: v29.11,41.66 29.11,50.72 35.61,57.23 35.61,66.85 36.47,67.72 X15.4
  Bottom 0.508: MOD1.P$4 41.91,68.45 36.96,68.45 X15.4
P4
  Bottom 0.508: X15.5 MOD1.P$5
P5
  Bottom 0.508: X15.6 36.83,63.63 41.78,63.63 MOD1.P$6
P6
  Top 0.254: IC3.4 29.06,47.24 29.06,50.75 35.36,57.05 35.36,58.98 36.47,60.1 X15.7
  Bottom 0.508: X15.7 MOD1.P$7
P7  (via drill 0.46)
  Top 0.203: v83.52,63.09 v87.83,67.41
  Bottom 0.203: v87.83,67.41 85.8,69.44 84.58,69.44 83.21,70.81 82.65,70.81 MOD4.P$8 | v83.52,63.09 81.94,63.09 79.1,65.94 64.06,65.94 62.74,67.26 51.05,67.26 42.52,58.73 MOD1.P$8
  Bottom 0.508: X15.8 MOD1.P$8
P8  (via drill 0.38)
  Top 0.203: v70.56,69.7 76.96,69.7 78.08,70.81 78.64,70.81 MOD4.P$9 | v66.09,65.23 v67.92,67.06
  Bottom 0.203: v67.92,67.06 v70.56,69.7 | v66.09,65.23 63.14,65.23 62.64,64.72 52.98,64.72 44.45,56.19 42.52,56.19 MOD1.P$9
  Bottom 0.508: X16.1 MOD1.P$9
P9  (via drill 0.38)
  Top 0.203: v80.47,61.11 v86.77,67.41
  Bottom 0.203: v86.77,67.41 85.14,69.04 79.91,69.04 78.13,70.81 77.57,70.81 MOD4.P$10 | v80.47,61.11 63.8,61.11 62.74,62.18 51.05,62.18 42.52,53.65 MOD1.P$10
  Bottom 0.508: X16.2 MOD1.P$10
P10
  Bottom 0.508: X16.3 MOD1.P$11
P11  (via drill 0.38)
  Top 0.203: v77.93,59.64 v85.7,67.41
  Bottom 0.203: v85.7,67.41 84.48,68.63 75.23,68.63 73.05,70.81 72.49,70.81 MOD4.P$12 | v77.93,59.64 53.59,59.64 42.52,48.56 MOD1.P$12
  Bottom 0.508: X16.4 MOD1.P$12
P12  (via drill 0.38, 0.46)
  Top 0.203: v98.45,62.59 97.99,62.59 90.53,70.05 83.97,70.05 83.01,71.02 83.01,71.58 82.4,72.19 70.71,72.19 69.95,71.42 MOD4.P$13 | v51.18,52.38 59.54,52.38 61.82,54.66 63.25,54.66 63.86,55.27 63.86,67.72 64.36,68.22 65.63,68.22 v66.14,67.72
  Bottom 0.203: v98.45,62.59 98.45,55.58 100.33,53.7 100.33,36.98 96.93,33.58 96.93,33.22 X8.5 | v51.18,52.38 44.83,46.02 42.52,46.02 MOD1.P$13 | v66.14,67.72 68.89,70.46 MOD4.P$13
  Bottom 0.508: X16.5 MOD1.P$13
P13
  Bottom 0.203: 93.57,58.47 95.71,56.34 95.71,52.12 94.59,51 94.59,46.48 95.1,45.97 95.1,45.16 96.47,43.79 97.54,43.79 97.74,43.59 97.74,39.12 96.93,38.3 X8.3 | 93.57,58.47 83.82,68.22 73.1,68.22 70.66,70.66 70.66,71.22 69.7,72.19 68.73,72.19 67.97,71.42 67.41,71.42 MOD4.P$14 | X16.6 36.47,44.04 36.47,44.35 35.61,45.21 35.61,46.23 36.42,47.04 42.93,47.04 53.09,57.2 62.94,57.2 63.09,57.35 79.45,57.35 80.82,55.98 80.82,55.42 81.43,54.81 92.56,54.81 93.52,55.78 93.52,58.42 93.57,58.47
  Bottom 0.508: X16.6 MOD1.P$14
P15  (via drill 0.38)
  Top 0.203: v66.78,21.34 67.11,21.34 68.78,23.01 68.78,23.22 IC6.5 | v64.77,25.15 64.77,21.34 v64.39,21.34
  Bottom 0.203: v64.39,21.34 v66.78,21.34 | v64.77,25.15 64.77,27.13 62.64,29.26 50.55,29.26 42.27,37.54 MOD1.P$16
  Bottom 0.508: X16.8 MOD1.P$16
P16
  Top 0.254: R2.2 46.38,35.15 46.38,36.63 R1.1 46.84,37.52 47.37,37.9 47.57,38.1 47.57,40.03 47.37,40.23 43.56,40.23 42.57,39.24 41.25,39.24 40.51,38.51 40.51,36.37 41.22,35.66 MOD1.P$17
  Bottom 0.508: X17.1 MOD1.P$17
P17  (via drill 0.38)
  Top 0.254: IC1.1 48.21,27.13 47.14,27.13 C1.1 46.38,27.64 46.38,28.5 RFH.1 45.82,29.46 v44.81,30.48
  Bottom 0.254: v44.81,30.48 42.52,32.77 MOD1.P$18
  Bottom 0.508: X17.2 MOD1.P$18
P18
  Bottom 0.508: X17.3 MOD1.P$19
P19  (via drill 0.38)
  Top 0.254: v30.12,31.7 29.06,32.77 IC4.2
  Bottom 0.254: v30.12,31.7 32.56,31.7 35.97,28.3 X17.4
  Bottom 0.508: X17.4 MOD1.P$20
P20  (via drill 0.38)
  Top 0.203: v69.44,21.79 69.44,23.22 IC6.4
  Bottom 0.203: v69.44,21.79 67.39,21.79 67.08,22.1 63.2,22.1 62.74,21.64 57,21.64 56.19,22.45 56.19,23.27 57.1,24.18 62.74,24.18 63.45,24.89 63.45,25.91 62.74,26.62 56.19,26.62 55.27,25.7 42.52,25.7 MOD1.P$21
  Bottom 0.508: X17.5 MOD1.P$21
P21
  Bottom 0.508: X17.6 MOD1.P$22
P22
  Bottom 0.508: X17.7 MOD1.P$23
P23
  Bottom 0.508: X17.8 MOD1.P$24
P24  (via drill 0.38)
  Top 0.203: v76.25,11.58 78.03,9.8 79.15,9.8 IC2.5 | v69.75,19.1 69.29,19.1 68.89,19.51 64.82,19.51 64.77,19.56 v64.72,19.76
  Bottom 0.203: v76.25,11.58 76.25,12.6 v69.75,19.1 | v64.72,19.76 63.09,18.14 X20.8
  Bottom 0.508: MOD1.P$25 X20.8
P25
  Bottom 0.508: MOD1.P$26 X20.7
P26
  Bottom 0.508: MOD1.P$27 X20.6
P27  (via drill 0.38)
  Top 0.254: v29.06,36.58 29.06,35.81 IC4.4
  Bottom 0.254: v29.06,36.58 29.06,23.88 31.29,21.64 53.09,21.64 56.54,25.09 MOD1.P$28
  Bottom 0.508: MOD1.P$28 X20.5
P28  (via drill 0.38)
  Top 0.254: v30.12,24.03 29.06,24.03 IC5.2
  Bottom 0.254: v30.12,24.03 33.73,24.03 36.42,26.72 55.63,26.72 56.54,27.64 MOD1.P$29
  Bottom 0.508: MOD1.P$29 57.15,28.07 62.1,28.07 X20.4
P29  (via drill 0.38)
  Top 0.203: v75.59,16.66 78.64,13.61 79.15,13.61 IC2.2 | v66.6,41.91 v73.71,41.91
  Bottom 0.203: v75.59,16.66 75.59,17.12 72.14,20.57 72.14,26.67 74.57,29.11 74.57,41.05 v73.71,41.91 | v66.6,41.91 59.79,41.91 56.95,39.06 56.74,39.06 56.19,38.51 56.19,31.75 56.84,31.09 MOD1.P$30
  Bottom 0.508: MOD1.P$30 X20.3
P30  (via drill 0.38)
  Top 0.203: v75.69,4.22 64.06,4.22 56.24,12.04 v53.03,12.04 | v52.58,19.76 53.39,19.76 56.19,22.55 56.19,31.75 56.84,32.41 MOD1.P$31
  Bottom 0.203: v75.69,4.22 95.76,24.28 X8.8 | v53.03,12.04 53.03,12.5 52.58,12.95 v52.58,19.76
  Bottom 0.508: MOD1.P$31 X20.2
P31  (via drill 0.38)
  Top 0.203: v73.61,29.21 82.91,29.21 88.95,23.16 96.67,23.16 97.74,24.23 97.74,25.3 96.93,26.11 96.93,26.47 96.88,26.52 X8.7
  Bottom 0.203: v73.61,29.21 72.03,30.79 72.03,35.97 71.22,36.78 63.45,36.78 X20.1
  Bottom 0.508: MOD1.P$32 57.15,35.69 62.1,35.69 X20.1
P32
  Top 0.203: X8.6 96.11,29.01 96.11,28.65 95.2,27.74 95.2,24.23 94.54,23.57 89.41,23.57 82.19,30.79 82.19,38.51 81.38,39.32 63.96,39.32 63.09,38.46 X19.8
  Bottom 0.508: MOD1.P$33 X19.8
P34  (via drill 0.38)
  Top 0.203: v91.69,31.19 95.05,31.19 95.2,31.34 95.2,32.82 96.11,33.73 96.11,34.09 X8.4 | v92.05,36.22 92.05,37.03 v89.56,39.52 | v74.12,45.11 64.67,45.11 63.09,43.54 X19.6
  Bottom 0.203: MOD4.P$15 66.34,55.17 66.34,53.19 62.64,49.48 57,49.48 56.19,48.67 56.19,44.45 56.84,43.79 MOD1.P$35 | v91.69,31.19 91.69,35.87 v92.05,36.22 | v89.56,39.52 88.8,39.52 83.21,45.11 v74.12,45.11
  Bottom 0.508: MOD1.P$35 X19.6
P35  (via drill 0.38)
  Top 0.203: v72.03,37.29 72.03,30.07 70.31,28.35 70.31,24.69 IC6.3
  Bottom 0.203: v72.03,37.29 72.03,38.51 70.81,39.73 69.8,39.73 64.16,45.36 63.09,45.36 X19.5
  Bottom 0.508: X19.5 MOD1.P$36
P36
  Bottom 0.203: MOD4.P$17 71.02,55.58 70.46,55.58 67.61,52.73 67.21,52.73 63.09,48.62 X19.4
  Bottom 0.508: MOD1.P$37 X19.4
P37  (via drill 0.38)
  Top 0.203: v77.57,11.33 77.83,11.07 79.15,11.07 IC2.4 | v54.15,21.59 v54.15,39.37
  Bottom 0.203: v77.57,11.33 77.06,11.33 76.56,10.82 75.95,10.82 74.37,12.39 74.37,12.65 71.12,15.9 66.09,15.9 62.89,12.7 60.76,12.7 59.33,14.12 57.96,14.12 54.15,17.93 v54.15,21.59 | v54.15,39.37 54.15,47.5 56.84,50.19 MOD1.P$38
  Bottom 0.508: MOD1.P$38 X19.3
P38  (via drill 0.38)
  Top 0.203: v72.9,21.95 72.03,21.95 70.97,23.01 70.97,23.22 IC6.2 | v70.71,47.45 67.72,47.45 62.64,52.53 X19.2
  Bottom 0.203: v72.9,21.95 72.9,24.89 77.11,29.11 77.11,41.05 v70.71,47.45
  Bottom 0.508: X19.2 MOD1.P$39
P39  (via drill 0.38)
  Top 0.203: X21.1 94.84,33.22 94.84,34.04 95.3,34.49 95.3,38 96.06,38.76 97.03,38.76 98.2,39.93 98.2,46.02 96.06,48.16 93.17,48.16 85.55,55.78 85.55,56.34 84.94,56.95 80.87,56.95 80.11,56.19 MOD4.P$20
  Top 0.254: v59.79,69.55 59.79,58.32 X19.1
  Bottom 0.203: MOD4.P$20 78.64,56.19 78.08,56.19 77.32,56.95 63.3,56.95 X19.1
  Bottom 0.254: v59.79,69.55 59.79,93.22 63.91,97.33 63.91,97.59 X5.1
  Bottom 0.508: MOD1.P$40 X19.1
P40  (via drill 0.38)
  Top 0.203: v91.54,43.79 91.19,43.79 86.82,48.16 86.82,51.31 82.6,55.52 MOD4.P$21
  Top 0.254: v61.01,69.65 61.01,60.15 61.87,59.28 X18.8
  Bottom 0.203: MOD4.P$21 81.23,56.24 79.4,58.06 63.09,58.06 X18.8 | v91.54,43.79 95,43.79 95.2,43.59 95.2,31.29 94.49,30.58 X21.2
  Bottom 0.254: v61.01,69.65 61.01,91.64 64.36,95 64.36,95.05 X5.2
  Bottom 0.508: MOD1.P$41 X18.8
P41
  Bottom 0.203: MOD4.P$22 83.72,56.19 83.16,56.19 78.74,60.6 63.09,60.6 X18.7
  Bottom 0.508: MOD1.P$42 X18.7
P42
  Bottom 0.203: MOD4.P$23 86.36,56.29 79.5,63.14 63.09,63.14 X18.6
  Bottom 0.508: MOD1.P$43 X18.6
P43  (via drill 0.38)
  Top 0.203: v73.61,12.34 79.15,12.34 IC2.3 | v53.34,20.88 53.34,39.27 48.26,44.35 v48.26,61.06
  Bottom 0.203: v73.61,12.34 72.19,12.34 69.04,15.49 66.29,15.49 61.87,11.07 58.32,11.07 57,9.75 56.39,9.75 53.34,12.8 v53.34,20.88 | v48.26,61.06 48.72,61.06 53.39,65.73 56.54,65.73 MOD1.P$44
  Bottom 0.508: MOD1.P$44 X18.5
P44
  Bottom 0.203: MOD4.P$25 91.44,56.29 81.38,66.34 64.36,66.34 62.79,67.92 X18.4
  Bottom 0.508: MOD1.P$45 X18.4
P47
  Top 1.27: X18.1 MOD1.P$48 51.98,76.2 J1.1

### Text on the board
tScreen: Gnd | +12V | IN- | IN+ | Vin | I2C OLED | 5V | Volume | - In + | 3.3V | 2-Pi Labs | 5V | Teensy Audio 4 | Gnd | LM2596, 3A PS module | Gnd | +5V | G | E2 | E1 | Teensy 4.1 | Vin | E2 | G | 5V | IN | OUT | E1 | 3V3 | RvH | MISO | Gnd | CLK | RvL | SDA | MOSI | G | Vref | SCL | P41 | VRH | +3V3 | Level | P40 | Shift | VCL | Vio | Gnd | P39 | EXP | 0.1uf | Level-Shifted | G | 5V | 12V | 3.3V | 5V | 0.1uf | P38 | 0.1uf | P22~ | MWC Mobo v1.0.7 | P16 | GPIO | P33~ | G | Rpu | G | O1 | V | G | O2 | V | G | O3 | V | G | O4 | V | <-- LED Strips